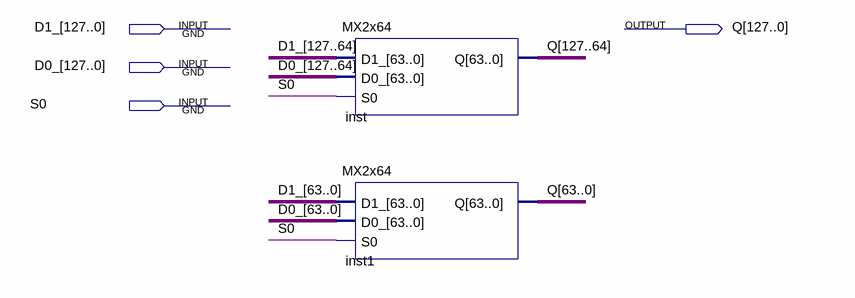
[diagram p0: schematic sheet]
// Quartus schematic MX2x128.bdf as structural Verilog: 2 symbols, 4 pins
module MX2x128 (
  input  [127:0] D1_,
  input  [127:0] D0_,
  input  S0,
  output [127:0] Q
);

  MX2x64 inst (.D1_(D1_[127:64]), .D0_(D0_[127:64]), .S0(S0), .Q(Q[127:64]));
  MX2x64 inst1 (.D1_(D1_[63:0]), .D0_(D0_[63:0]), .S0(S0), .Q(Q[63:0]));
endmodule
